# EAGLE design main_ready (EAGLE 9.2.2)
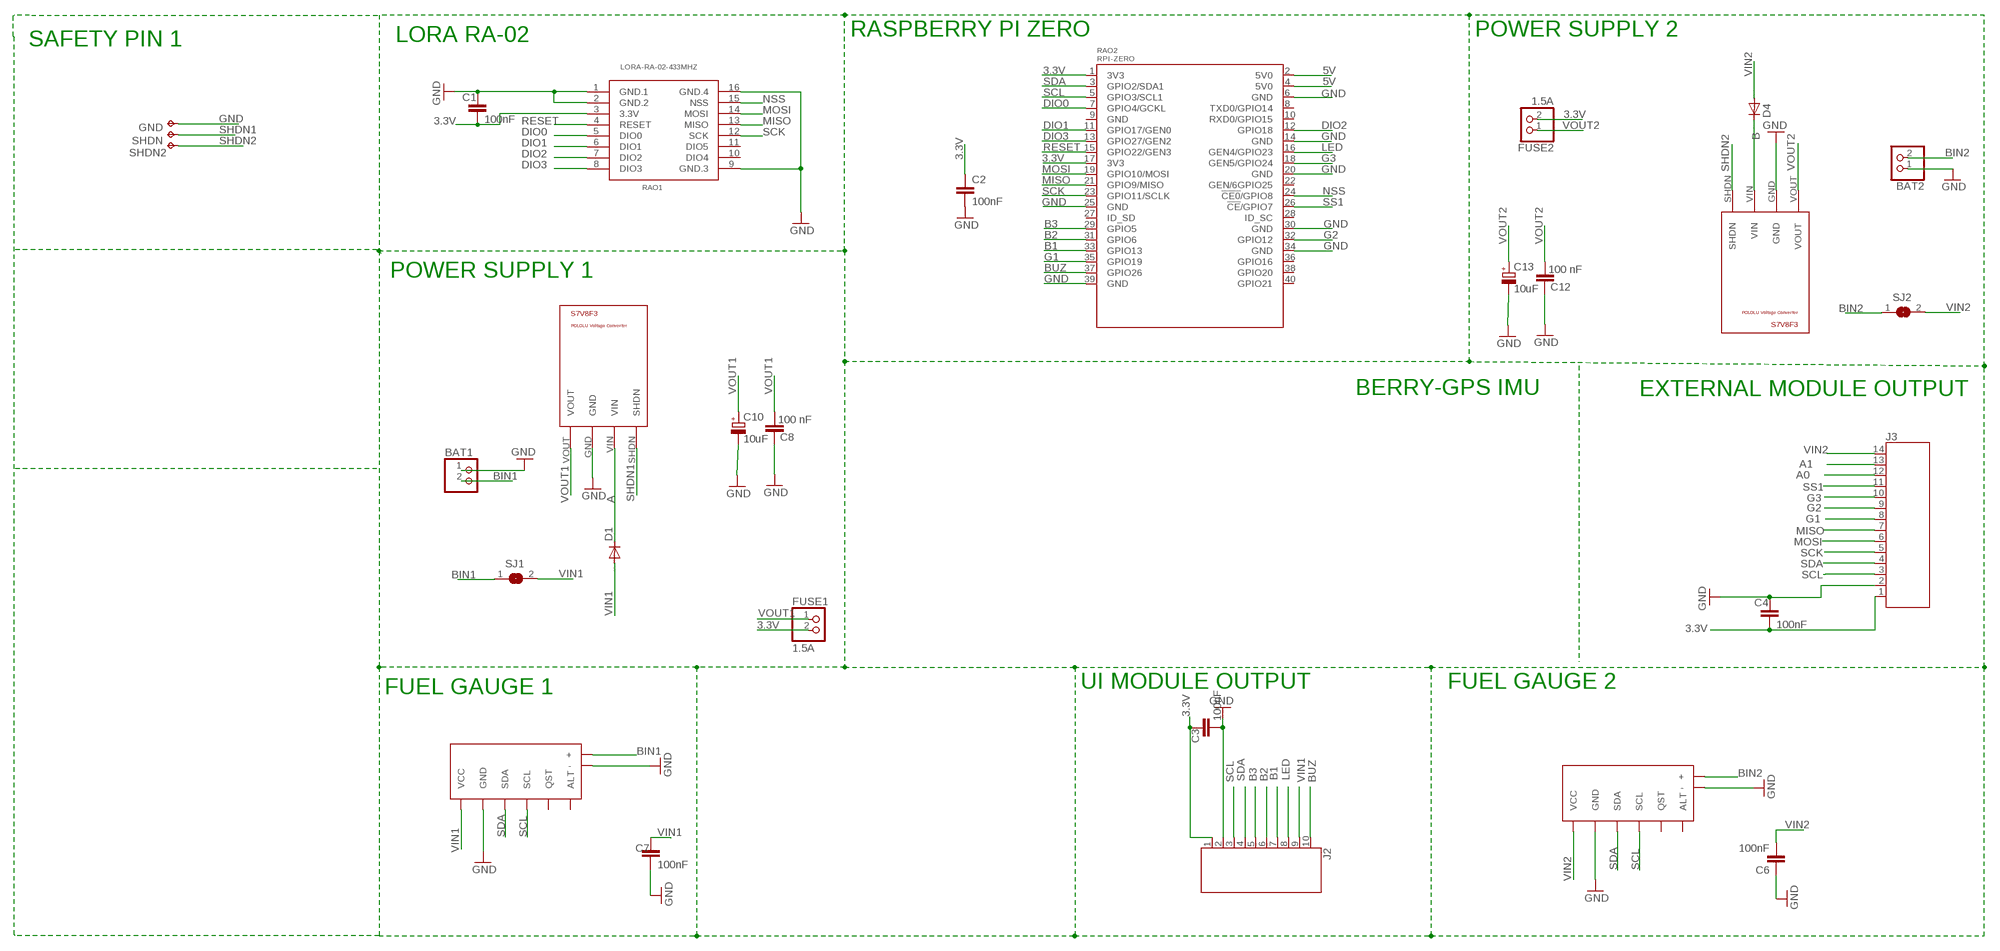
[diagram p0: schematic, sheet 1]

## Parts
BAT1  PINHD-1X2  [1X02]
BAT2  PINHD-1X2  [1X02]
C1  100nF  C-EUC0805  [C0805]
C2  100nF  C-EUC0805  [C0805]
C3  100nF  C-EUC0805  [C0805]
C4  100nF  C-EUC0805  [C0805]
C6  100nF  C-EUC0805  [C0805]
C7  100nF  C-EUC0805  [C0805]
C8  100 nF  C-EUC0805  [C0805]
C10  10uF  CPOL-EUSMCA  [SMC_A]
C12  100 nF  C-EUC0805  [C0805]
C13  10uF  CPOL-EUSMCA  [SMC_A]
D1  CGRM4001-G  [SOD-123_MINI-SMA]
D4  CGRM4001-G  [SOD-123_MINI-SMA]
FUSE1  1.5A  PINHD-1X2  [1X02]
FUSE2  1.5A  PINHD-1X2  [1X02]
GND  TPTP19R  [TP19R]
J2  686110183522  [686110183522]
J3  686114183522  [686114183522]
RAO1  LORA-RA-02-433MHZ  [LORA-RA2-SMD]
RAO2  RPI-ZERO  [RASPBERRYPI_BASTELSTUBE_V13_RASPI_BOARD_B+_FULL]
RAO3  S7V8F3  [S7V8F3]
RAO4  S7V8F3  [S7V8F3]
SHDN  TPTP19R  [TP19R]
SHDN2  TPTP20R  [TP20R]
SJ1  SJW  [SJW]
SJ2  SJW  [SJW]
U$3  POLOLU_FUEL_GAUGEBREAKBOARD  [BREAKBOARD]
U$9  POLOLU_FUEL_GAUGEBREAKBOARD  [BREAKBOARD]

## Nets
3.3V: C1.2 C2.1 C3.1 C4.2 FUSE1.2 FUSE2.2 J2.1 J3.1 RAO1.3(3.3V) RAO2.1(3V3) RAO2.17(3V3)
5V: RAO2.2(5V0) RAO2.4(5V0)
A: D1.C RAO3.VIN
A0: J3.12
A1: J3.13
B: D4.C RAO4.VIN
B1: J2.7 RAO2.33(GPIO13)
B2: J2.6 RAO2.31(GPIO6)
B3: J2.5 RAO2.29(GPIO5)
BIN1: BAT1.2 SJ1.1 U$3.+
BIN2: BAT2.2 SJ2.1 U$9.+
BUZ: J2.10 RAO2.37(GPIO26)
DIO0: RAO1.5(DIO0) RAO2.7(GPIO4/GCKL)
DIO1: RAO1.6(DIO1) RAO2.11(GPIO17/GEN0)
DIO2: RAO1.7(DIO2) RAO2.12(GPIO18)
DIO3: RAO1.8(DIO3) RAO2.13(GPIO27/GEN2)
G1: J3.8 RAO2.35(GPIO19)
G2: J3.9 RAO2.32(GPIO12)
G3: J3.10 RAO2.18(GEN5/GPIO24)
GND: BAT1.1 BAT2.1 C1.1 C2.2 C3.2 C4.1 C6.1 C7.2 C8.2 C10.- C12.2 C13.- GND.TP J2.2 J3.2 RAO1.1(GND.1) RAO1.2(GND.2) RAO1.9(GND.3) RAO1.16(GND.4) RAO2.6(GND) RAO2.14(GND) RAO2.20(GND) RAO2.25(GND) RAO2.30(GND) RAO2.34(GND) RAO2.39(GND) RAO3.GND RAO4.GND U$3.- U$3.GND U$9.- U$9.GND
LED: J2.8 RAO2.16(GEN4/GPIO23)
MISO: J3.7 RAO1.13(MISO) RAO2.21(GPIO9/MISO)
MOSI: J3.6 RAO1.14(MOSI) RAO2.19(GPIO10/MOSI)
NSS: RAO1.15(NSS) RAO2.24(!CE0!/GPIO8)
RESET: RAO1.4(RESET) RAO2.15(GPIO22/GEN3)
SCK: J3.5 RAO1.12(SCK) RAO2.23(GPIO11/SCLK)
SCL: J2.3 J3.3 RAO2.5(GPIO3/SCL1) U$3.SCL U$9.SCL
SDA: J2.4 J3.4 RAO2.3(GPIO2/SDA1) U$3.SDA U$9.SDA
SHDN1: RAO3.SHDN SHDN.TP
SHDN2: RAO4.SHDN SHDN2.TP
SS1: J3.11 RAO2.26(!CE!/GPIO7)
VIN1: C7.1 D1.A J2.9 SJ1.2 U$3.VCC
VIN2: C6.2 D4.A J3.14 SJ2.2 U$9.VCC
VOUT1: C8.1 C10.+ FUSE1.1 RAO3.VOUT
VOUT2: C12.1 C13.+ FUSE2.1 RAO4.VOUT
Unconnected: RAO1.10(DIO4) RAO1.11(DIO5) RAO2.8(TXD0/GPIO14) RAO2.9(GND) RAO2.10(RXD0/GPIO15) RAO2.22(GEN/6GPIO25) RAO2.27(ID_SD) RAO2.28(ID_SC) RAO2.36(GPIO16) RAO2.38(GPIO20) RAO2.40(GPIO21) U$3.ALT U$3.QST U$9.ALT U$9.QST

## Notes on the sheet
- LORA RA-02 | RASPBERRY PI ZERO | POWER SUPPLY 2
- SAFETY PIN 1
- POWER SUPPLY 1
- BERRY-GPS IMU | EXTERNAL MODULE OUTPUT
- FUEL GAUGE 1 | UI MODULE OUTPUT | FUEL GAUGE 2

## Library data of the parts
BAT1 BAT2 FUSE1 FUSE2 = pinhead:PINHD-1X2: PIN HEADER
C1-C4 C6-C8 C12 = rcl:C-EU: CAPACITOR, European symbol; SPICEPREFIX: C
C10 C13 = rcl:CPOL-EU: POLARIZED CAPACITOR, European symbol; SPICEPREFIX: C
D1 D4 = diode:CGRM400*-G: Molded plasitc,JEDEC SOD-123/Mini SMA Source: Comchip CGRM4001-G.pdf
GND SHDN SHDN2 = testpad:TP: Test pad
J2 = Wurth_Elektronik_Electromechanic_FPC_Connectors_&_Flat_Flexible_Cable_rev18c:686110183522: 686110183522 WR-FPC 1.00mm SMT Horizontal Bottom Contact - Low Profile <http://katalog.we-online.de/media/images/v2/Family_WR-FPC_6861xx183522.jpg> Details see: http://katalog.we-online.de/en/em/FPC_1_00_SMT_ZIF_HORIZONTAL_BOTTOM_CONTACT_LOW_PROFILE_6861xx183522 Created by Yingchun,shan 2016 (C) Wurth Elektronik
J3 = Wurth_Elektronik_Electromechanic_FPC_Connectors_&_Flat_Flexible_Cable_rev18c:686114183522: 686114183522 WR-FPC 1.00mm SMT Horizontal Bottom Contact - Low Profile <http://katalog.we-online.de/media/images/v2/Family_WR-FPC_6861xx183522.jpg> Details see: http://katalog.we-online.de/en/em/FPC_1_00_SMT_ZIF_HORIZONTAL_BOTTOM_CONTACT_LOW_PROFILE_6861xx183522 Created by Yingchun,shan 2016 (C) Wurth Elektronik
RAO1 = LikeCircuit:LORA-RA-02-433MHZ: 433 MHz Lora Ra-02 Radio Transceiver Module based on SX1276 chip. Visit our more eagle PCB <https://www.likecircuit.com/>
RAO2 = RPI-Zero:RPI-ZERO
RAO3 RAO4 = POLOLU-VoltageConverter:S7V8F3
SJ1 SJ2 = jumper:SJ: SMD solder JUMPER
U$3 U$9 = SparFun-FuelGauge:POLOLU_FUEL_GAUGE

## Board
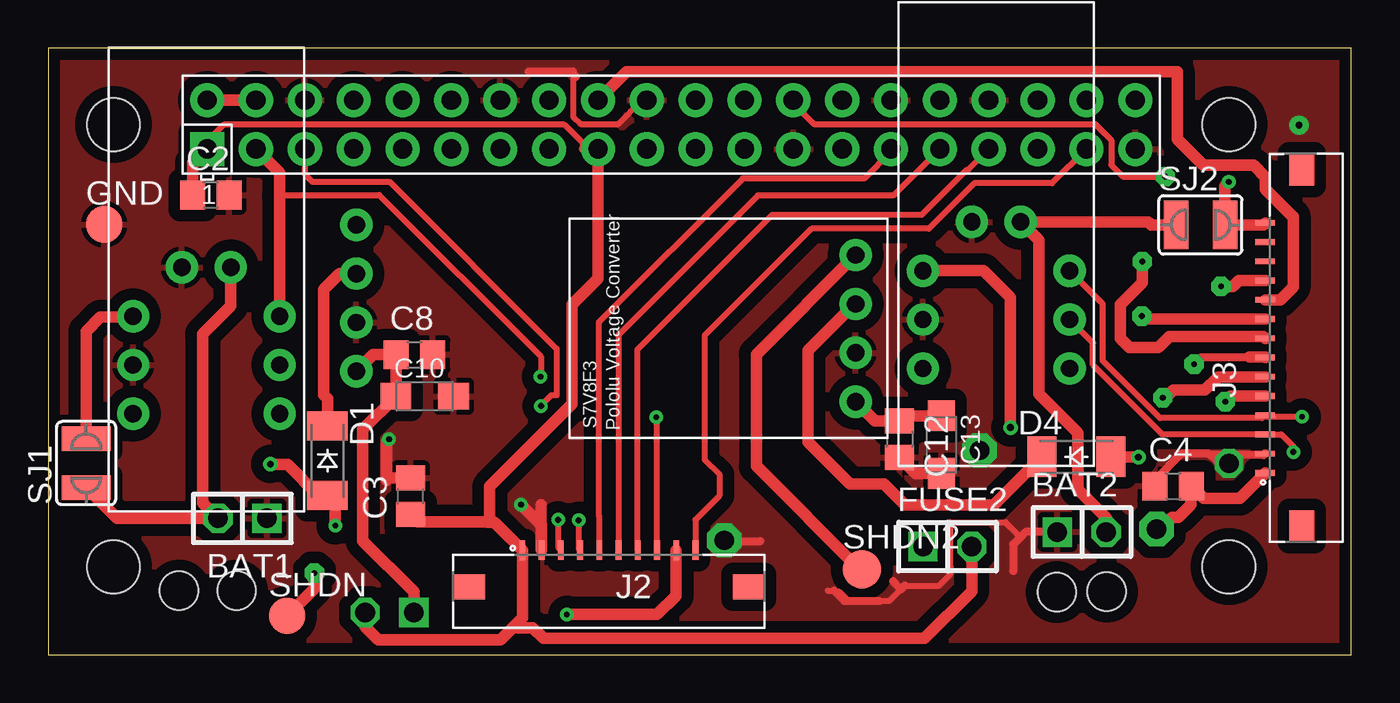
[diagram p1: board, top side]
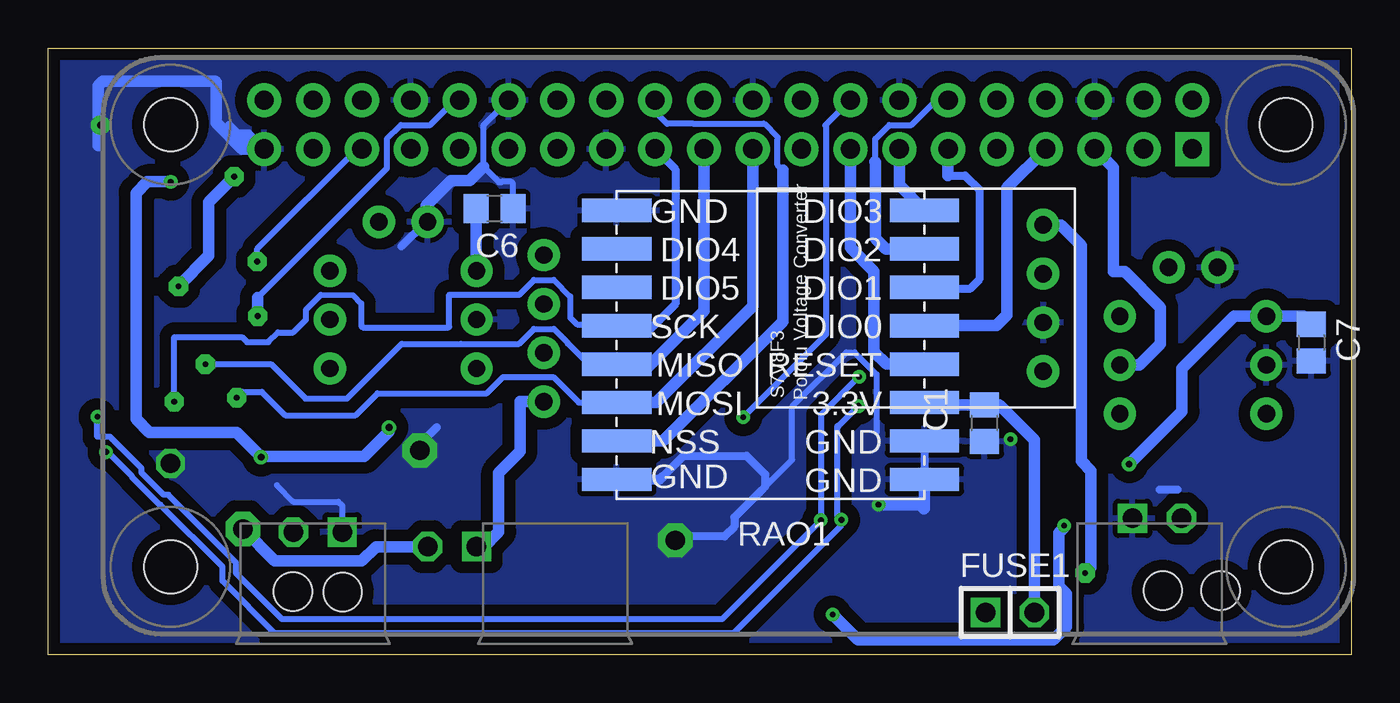
[diagram p2: board, bottom side, seen from below]

Size 67.77 x 31.55 mm. Coordinates in mm from the lower left corner, seen from the top.
Outline: 0,0 67.77,0 67.77,31.55 0,31.55 0,0
Copper layers (1*16): Top 0.035mm / dielectric 1.5mm / Bottom 0.035mm
Design rules "default *": minimum track width 8mil, minimum drill 0.3mm, track to track 8mil, track to pad 8mil, pad to pad 8mil, via to via 8mil, smd to smd 8mil, copper to edge 10mil, drill to drill 8mil, minimum pad ring 10mil, minimum via ring 8mil, stop-mask expansion 4mil, vias tented up to drill 0mil, thermal gap 10mil
Holes 2 mm at 52.45,3.25 55.04,3.28 6.81,3.33 9.8,3.33

### Footprints (pad centres in the part's own frame; a part is rotated, then mirrored left to right if it is on the bottom)
1X02 = drill 1.016 square: 1 -1.27,0 | drill 1.016 octagon: 2 1.27,0
C0805 = smd 1.3 x 1.5: 1 -0.95,0; 2 0.95,0
SMC_A = smd 1.6 x 1.4: + -1.5,0; - 1.5,0
SOD-123_MINI-SMA = smd 1.5 x 2.1: A 1.8,0; C -1.8,0
TP19R = smd 1.9 x 1.9: TP 0,0
686110183522 = smd 0.3 x 1: 1 -4.5,1.9; 2 -3.5,1.9; 3 -2.5,1.9; 4 -1.5,1.9; 5 -0.5,1.9; 6 0.5,1.9; 7 1.5,1.9; 8 2.5,1.9; 9 3.5,1.9; 10 4.5,1.9 | smd 1.65 x 1.3: Z1 -7.275,0; Z2 7.275,0
686114183522 = smd 0.3 x 1: 1 -6.5,1.9; 2 -5.5,1.9; 3 -4.5,1.9; 4 -3.5,1.9; 5 -2.5,1.9; 6 -1.5,1.9; 7 -0.5,1.9; 8 0.5,1.9; 9 1.5,1.9; 10 2.5,1.9; 11 3.5,1.9; 12 4.5,1.9; 13 5.5,1.9; 14 6.5,1.9 | smd 1.65 x 1.3: Z1 -9.275,0; Z2 9.275,0
LORA-RA2-SMD = smd 3.6 x 1.2: 1 -8,7; 2 -8,5; 3 -8,3; 4 -8,1; 5 -8,-1; 6 -8,-3; 7 -8,-5; 8 -8,-7; 9 8,-7; 10 8,-5; 11 8,-3; 12 8,-1; 13 8,1; 14 8,3; 15 8,5; 16 8,7
RASPBERRYPI_BASTELSTUBE_V13_RASPI_BOARD_B+_FULL = drill 1 pad 1.778 square: 1 8.37,25.23 | drill 1 pad 1.778: 2 8.37,27.77; 3 10.91,25.23; 4 10.91,27.77; 5 13.45,25.23; 6 13.45,27.77; 7 15.99,25.23; 8 15.99,27.77; 9 18.53,25.23; 10 18.53,27.77; 11 21.07,25.23; 12 21.07,27.77; 13 23.61,25.23; 14 23.61,27.77; 15 26.15,25.23; 16 26.15,27.77; 17 28.69,25.23; 18 28.69,27.77; 19 31.23,25.23; 20 31.23,27.77; 21 33.77,25.23; 22 33.77,27.77; 23 36.31,25.23; 24 36.31,27.77; 25 38.85,25.23; 26 38.85,27.77; 27 41.39,25.23; 28 41.39,27.77; 29 43.93,25.23; 30 43.93,27.77; 31 46.47,25.23; 32 46.47,27.77; 33 49.01,25.23; 34 49.01,27.77; 35 51.55,25.23; 36 51.55,27.77; 37 54.09,25.23; 38 54.09,27.77; 39 56.63,25.23; 40 56.63,27.77 | hole 2.75: 3.5,3.5; 3.5,26.5; 61.5,3.5; 61.5,26.5
S7V8F3 = drill 0.9 pad 1.676: GND -1.27,-6.35; SHDN 3.81,-6.35; VIN 1.27,-6.35; VOUT -3.81,-6.35
TP20R = smd 2 x 2: TP 0,0
SJW = smd 1.27 x 2.54: 1 -1.27,0; 2 1.27,0
BREAKBOARD = drill 0.9 pad 1.676: + 1.27,8.89; - -1.27,8.89; ALT -3.81,1.27; GND -3.81,3.81; QST 3.81,1.27; SCL 3.81,3.81; SDA 3.81,6.35; VCC -3.81,6.35

### Placement (x,y rotation side)
BAT1  10.11,7.09 180 top
BAT2  53.75,6.38 0 top
C1  19.08,12.04 90 bottom
C2  8.46,23.9 0 top
C3  18.85,8.23 90 top
C4  58.5,8.76 0 top
C6  44.55,23.19 180 bottom
C7  2.08,16.23 270 bottom
C8  19.05,15.6 0 top
C10  19.58,13.44 0 top
C12  44.27,11.2 270 top
C13  46.46,10.92 270 top
D1  14.53,10.08 270 top
D4  53.47,10.29 0 top
FUSE1  17.75,2.18 0 bottom
FUSE2  46.76,5.61 0 top
GND  2.92,22.38 0 top
J2  29.16,3.53 0 top
J3  65.18,15.95 90 top
RAO1  30.2,16.1 180 bottom
RAO2  -0.1,1.07 0 top
RAO3  22.38,18.54 90 bottom
RAO4  35.64,16.97 90 top
SHDN  12.42,2.01 0 top
SHDN2  42.32,4.45 0 top
SJ1  1.98,9.96 90 top
SJ2  59.92,22.35 0 top
U$3  8.23,11.25 0 top
U$9  49.3,13.61 0 top

### Tracks (layer width: path | path; a pad name or v marks a point on that pad's centre or on a via)
3.3V  (via drill 1 pad 1.78)
  Top 0.305: RAO2.1 8.27,26.34 8.27,26.71 9.12,27.56 26.85,27.56 27.81,26.6 27.81,26.3
  Top 0.406: 27.81,26.3 RAO2.17
  Top 0.61: J3.1 61.95,8.13 60.08,8.13 C4.2 59.42,8.73 59.42,7.8 58.75,7.14 58.42,7.14 57.81,6.53 v57.63,6.53 | 22.86,6.9 22.89,6.88 23.21,6.88 J2.1 24.66,1.9 24.16,1.4 | C3.1 19.22,6.9 22.86,6.9 | C2.1 7.51,25.58 8.27,26.34 | 24.16,1.4 23.52,0.76 17.17,0.76 16.48,1.45 FUSE1.2 | RAO2.17 28.59,19.55 27.25,18.21 27.25,13.03 22.96,8.74 22.96,7 22.86,6.9 | 24.16,1.4 25.2,1.4 25.76,0.84 45.57,0.84 48.03,3.3 FUSE2.2
  Bottom 0.61: RAO1.3 22.3,13 21.03,13 21.02,12.99 C1.2 18.3,12.99 16.48,11.18 FUSE1.2 | v57.63,6.53 55.98,4.88 51.46,4.88 50.72,5.61 FUSE2.2
5V
  Top 0.61: RAO2.2 RAO2.4
A
  Top 0.61: D1.C 14.53,13.31 14.33,13.51 14.33,18.97 15.16,19.81 RAO3.VIN
B
  Top 0.61: RAO4.VIN 41.99,18.29 39.52,15.83 39.52,11.05 41.68,8.89 43.45,8.89 44.54,7.8 49.18,7.8 D4.C
B1
  Top 0.305: J2.7 30.63,5.46 30.63,15.85 37.64,22.86 45.42,22.86 47.78,25.22 47.83,25.22 RAO2.33
B2
  Top 0.305: RAO2.31 43.95,23.88 36.91,23.88 29.66,16.63 J2.6
B3
  Top 0.305: RAO2.29 43.83,26.15 42.44,24.76 36.12,24.76 28.63,17.27 28.63,7.24 28.66,7.21 J2.5
BIN1
  Top 0.61: SJ1.1 3.58,7.09 BAT1.2 8.03,7.9 8.03,16.66 9.5,18.14 U$3.+
BIN2
  Top 0.61: SJ2.1 57.35,22.35 57.2,22.5 U$9.+ 51.51,21.56 51.51,13.56 53.54,11.53 53.54,8.58 55.02,7.11 BAT2.2
BUZ
  Top 0.305: J2.10 33.66,7.01 34.9,8.25 34.9,9.37 34.14,10.13 34.14,16.59 39.7,22.15 45.8,22.15 48.16,24.51 52.2,24.51 RAO2.37
DIO0
  Bottom 0.61: RAO2.7 17.91,24.28 17.91,17.65 18.46,17.1 RAO1.5
DIO1
  Bottom 0.406: 20.97,24.92 20.09,24.92 19.35,24.18 19.35,19.51 19.84,19.02 21.34,19.02
  Bottom 0.61: RAO2.11 20.97,24.92 | 21.34,19.02 21.42,19.1 RAO1.6
DIO2
  Bottom 0.305: RAO2.12 21.58,28.84 22.88,27.54 24.02,27.54 24.75,26.81 24.75,25.67
  Bottom 0.406: 24.77,25.65 24.75,25.67
  Bottom 0.61: RAO1.7 24.2,21.1 24.74,21.64 24.74,25.62 24.77,25.65
DIO3
  Bottom 0.61: RAO2.13 23.51,24.41 RAO1.8
G1  (via drill 0.3 pad 1)
  Top 0.61: v56.9,20.45 56.9,19.35 55.75,18.21 55.75,16.43 56.21,15.98 57.73,15.98 58.31,16.55 63.17,16.55 J3.8
  Bottom 0.305: v56.9,20.45 56.9,21.11 51.71,26.3 RAO2.35
G2  (via drill 0.3 pad 1)
  Top 0.61: J3.9 56.87,17.45 v56.87,17.6
  Bottom 0.305: RAO2.32 46.6,28.84 47.9,27.54 49.42,27.54 50.15,26.81 50.15,25.28 56.87,18.57
  Bottom 0.61: 56.87,18.57 v56.87,17.6
G3
  Top 0.61: RAO2.18 30.08,30.33 58.71,30.33 58.71,26.81 60.07,25.45 62.69,25.45 63.3,24.84 63.3,24.21 64.72,22.78 64.74,22.78 64.74,19.13 64.07,18.45 J3.10
GND  (via drill 0.3, 0.35 pad 1, 1 pad 1, 1 pad 1.78)
  Top 0.305: 40.54,3.32 40.87,3.32 | 41.4,2.79 41.53,2.79 | 43.21,2.79 43.74,2.79 44.35,3.4 | 27.15,30.33 27.31,30.17 27.31,27.97 27.68,27.59 29.62,27.59 30.87,28.84 RAO2.20 | 44.53,3.58 46.33,3.58 46.91,4.17 46.91,6.88 49.78,6.88 50.56,6.11
  Top 0.406: C4.1 57.55,9.07 58.93,10.45 60.35,10.45 60.43,10.37 60.48,10.37 | J3.2 63.2,10.37 60.48,10.37 | 27.43,30.05 27.28,30.2 27.28,30.33 27.15,30.33 25,30.33 | v35.15,5.94 35.1,5.89 37.03,5.89 | v48.44,10.62 48.34,10.52 47.93,10.52 | BAT2.1 50.83,6.38 50.56,6.11 50.19,5.74 50.19,4.34 | 44.53,3.58 44.35,3.4 43.94,3.81 | 40.87,3.32 40.97,3.23 | 40.97,3.23 41.4,2.79 | 40.97,3.23 41.1,3.23 41.53,2.79 43.21,2.79 | 60.48,10.37 60.96,9.89 61.35,9.89 v61.4,9.94
  Top 0.61: 25.63,7.8 25.63,5.46 J2.2 25.66,6.73 v24.59,7.8 | C3.2 17.71,9.18 17.6,9.07 17.6,11.07 17.7,11.18 v17.73,11.2 | C12.2 45.1,9.42 C13.-
  Bottom 0.305: BAT2.1 52.48,7.75 52.68,7.95 55.02,7.95 55.88,8.81 | 30.68,8.53 29.08,10.13 29.08,12.9 26.26,15.72 25.83,15.72 24.69,14.58 24.69,11.56 | C6.1 43.6,24.5 43.69,24.59 44.17,24.59 44.2,24.56 44.32,24.56 45.14,25.37 45.14,25.77 45.12,25.78 45.12,26.81 45.14,26.82 45.14,27.53 RAO2.30
  Bottom 0.406: 57.91,27.1 58.37,27.56 | 57.91,27.1 57.11,26.3 RAO2.39 57.33,27.1 57.91,27.1 | 49.39,21.24 48.12,22.5 U$9.- | 35.84,9.22 34.72,10.34 31.45,10.34 30.48,9.37 30.48,8.74 30.68,8.53 32.08,7.14 32.08,6.65 32.59,6.15 34.95,6.15 v35.15,5.94 | 47.55,11.84 48.44,10.95 v48.44,10.62 | 44.19,28.84 RAO2.30 | RAO1.2 RAO1.1 | v61.4,9.94 61.66,9.69 | 9.98,8.58 9.04,8.58
  Bottom 0.508: RAO1.16 35.96,9.1 35.84,9.22
  Bottom 0.61: RAO2.39 57.67,26.3 59.03,27.66 59.03,29.77 59.08,29.82 64.92,29.82 65.15,29.59 65.15,27.43 | 65.15,26.47 65.15,27.43 | 65.15,27.43 v65.05,27.53 | 45.14,25.37 45.85,24.66 46.81,24.66 48.12,23.35 48.12,22.5 | v24.59,7.8 22.45,7.8 22.23,7.57 22.2,7.59 RAO1.1
  pour Top (isolate 0.61): -30.43,-15.65 -32.72,-17.93 94.89,-17.93 98.02,-14.81 98.02,49.86 98.25,50.09 -27.74,50.09 -29.59,48.23 -29.59,45.92 -30.43,45.11 -30.48,45.16 -30.48,45.14
  pour Bottom (isolate 0.61): -28.98,45.36 -28.98,-15.62 -27.3,-17.3 98.65,-17.3 99.06,-16.89 99.26,-16.69 99.26,48.92 -25.22,48.92 -27.3,46.84 -28.78,45.36 -28.98,45.42 -29.01,45.39
LED  (via drill 0.3)
  Top 0.305: J2.8 31.66,12.28 31.67,12.29 v31.62,12.34
  Bottom 0.305: 27.36,27.53 27.32,27.57 | 27.32,27.57 RAO2.16 | 27.32,27.57 27.32,16.65 v31.62,12.34
MISO  (via drill 0.3 pad 1)
  Top 0.406: v59.59,15.1 59.95,15.47 62.46,15.47
  Top 0.61: 62.46,15.47 63.26,15.47 J3.7
  Bottom 0.305: v59.59,15.1 56.18,15.1 54.38,13.31 52.22,13.31 49.37,16.15 46.3,16.15 43.29,16.15 42.5,16.94 41.47,16.94 40.74,16.21 40.74,16.18 39.67,15.1 RAO1.13
  Bottom 0.61: RAO2.21 33.67,17.87 36.75,14.78 37.07,15.1 RAO1.13
MOSI  (via drill 0.3 pad 1)
  Top 0.61: J3.6 60.84,14.45 60.15,13.76 58.51,13.76 58.1,13.35 v57.96,13.36
  Bottom 0.305: v57.96,13.36 57.66,13.66 56.66,13.66 55.44,12.45 51.78,12.45 50.63,13.59 44.95,13.59 44.12,14.43 42.55,14.43 41.5,14.43 40.17,13.1 RAO1.14
  Bottom 0.61: RAO2.19 31.13,18.14 36.16,13.11 38.05,13.11 38.05,13.1 RAO1.14
NSS
  Bottom 0.305: 29.57,25.2 29.83,25.46 29.83,26.81 29.82,26.83 29.82,26.9 30.53,27.61 30.6,27.61 30.61,27.59 34.18,27.59 34.2,27.61 35.59,27.61 36.21,28.23
  Bottom 0.406: 36.21,28.23 RAO2.24
  Bottom 0.61: RAO1.15 35.78,11.1 29.57,17.32 29.57,25.2
RESET
  Bottom 0.61: RAO1.4 24.17,15.1 24.82,15.75 24.82,19.91 26.06,21.16 26.06,26.28 RAO2.15
SCK  (via drill 0.3 pad 1)
  Top 0.61: v61.21,13.16 61.51,13.45 J3.5
  Bottom 0.305: v61.21,13.16 61.21,16.48 61.19,16.51 57.68,16.51 57.43,16.26 56.31,16.26 55.81,16.76 55.02,16.76 54.36,17.42 54.36,17.94 53.58,18.72 51.92,18.69 51.49,18.26 51.49,17.09 51.41,17.02 46.94,17.02 46.91,17.04 46.91,18.72 43.26,18.72 42.5,19.48 41.47,19.48 40.61,18.63 40.61,17.53 40.26,17.17 39.42,17.17
  Bottom 0.406: RAO2.23 35.15,25.24 35.15,18.24 36.47,16.92 36.65,16.92
  Bottom 0.508: 39.42,17.17 38.27,17.17 RAO1.12
  Bottom 0.61: 36.65,16.92 36.84,17.1 RAO1.12
SCL  (via drill 0.3)
  Top 0.305: U$9.SCL 54.33,16.21 54.33,15.07 57.94,11.45 J3.3 64.11,11.45 64.11,11.46 64.75,10.81 v64.75,10.53 | RAO2.5 13.35,24.98 13.74,24.59 17.75,24.59 26.44,15.9 26.44,13.49 26.16,13.49 25.7,13.03 25.7,13 v25.63,12.93 | v26.52,7.01 26.52,5.57 J2.3
  Bottom 0.305: v25.63,12.93 26.67,11.89 26.75,11.89 26.75,7.24 v26.52,7.01 26.52,6.73 32.13,1.12 55.98,1.12 58.7,3.84 58.7,4.57 61.93,7.8 61.97,7.8 63.41,9.24 63.41,9.29 64.67,10.54 64.85,10.54 64.84,10.53 v64.75,10.53
  Bottom 0.61: RAO2.5 12.37,25.32 12.37,19.91 11.79,19.91 9.93,18.06 9.93,16.15 11.02,15.06 U$3.SCL
SDA  (via drill 0.3)
  Top 0.305: U$9.SDA 54.83,18.24 54.83,15.28 57.81,12.3 63.13,12.3 J3.4 63.36,12.37 v65.2,12.37 | 12.04,23.82 12.12,23.9 17.22,23.9 25.63,15.49 25.63,14.48 v25.6,14.45 | v27.58,6.98 27.58,5.51 J2.4
  Top 0.61: RAO2.3 12.04,25.07 12.04,23.82 U$3.SDA
  Bottom 0.305: v25.6,14.45 27.58,12.47 v27.58,6.98 32.72,1.84 55.6,1.84 57.99,4.23 57.99,4.77 61.52,8.31 61.76,8.31 62.91,9.45 62.91,9.69 64.54,11.33 65.2,11.33 v65.2,12.37
SHDN1  (via drill 0.3 pad 1)
  Top 0.61: SHDN.TP 13.84,3.43 v13.84,4.24
  Bottom 0.61: v13.84,4.24 13.54,4.55 13.54,9.56 14.05,10.07 14.05,21.28 15.11,22.35 RAO3.SHDN
SHDN2
  Top 0.61: RAO4.SHDN 36.83,15.62 36.83,9.8 42.19,4.44 SHDN2.TP
SS1  (via drill 0.3 pad 1)
  Top 0.305: v58.09,24.87 55.88,24.87 55.28,25.46 55.28,26.76 54.45,27.59 39.81,27.59 38.75,28.65 RAO2.26 38.75,28.59
  Top 0.61: v60.99,19.15 61.6,19.15 61.9,19.46 J3.11
  Bottom 0.61: v58.09,24.87 59.41,23.55 59.41,20.75 60.99,19.18 v60.99,19.15
VIN1  (via drill 0.3, 0.35)
  Top 0.61: SJ1.2 1.98,16.81 2.72,17.55 4.37,17.55 U$3.VCC | v11.56,9.91 11.73,9.91 11.76,9.88 12.45,9.88 14.04,8.28 D1.A 14.94,7.88 v14.94,6.71 | J2.9 32.66,3.07 31.67,2.08 v26.97,2.08
  Bottom 0.61: C7.1 2.5,17.6 U$3.VCC 6.1,17.6 8.81,14.88 8.81,12.65 v11.56,9.91 | v26.97,2.08 25.65,0.76 15.49,0.76 14.81,1.45 14.81,3.15 15.21,3.56 15.21,6.32 14.94,6.6 v14.94,6.71
VIN2  (via drill 0.3, 0.35)
  Top 0.61: J3.14 63.18,22.35 SJ2.2 61.19,24.36 61.39,24.56 v61.39,24.59 | U$9.VCC 48.64,19.96 50.04,18.57 50.04,11.89 50.01,11.86 50.04,11.84 v50.04,11.81 | v56.69,10.26 56.67,10.29 D4.A
  Bottom 0.61: v50.04,11.81 50.04,11.61 51.33,10.31 56.72,10.31 | 56.72,10.31 56.72,10.29 v56.69,10.26 | v61.39,24.59 62.61,24.59 63.2,24 63.2,12.24 62.51,11.56 57.96,11.56 56.72,10.31 | C6.2 45.5,19.97 U$9.VCC
VOUT1
  Top 0.61: RAO3.VOUT 16.89,15.6 C8.1 18.08,15.58 C10.+ 16.36,11.71 16.36,5.92 19.02,3.25 FUSE1.1
VOUT2
  Top 0.61: C13.+ 44.54,12.42 C12.1 42.99,12.15 RAO4.VOUT
  Bottom 0.61: RAO4.VOUT 43.23,13.16 43.23,10.56 44.34,9.45 44.34,6.39 45.11,5.61 FUSE2.1